# Altium schematic sheet PCB_WOOD-WORKSHOP-REV1.SchDoc
size A4
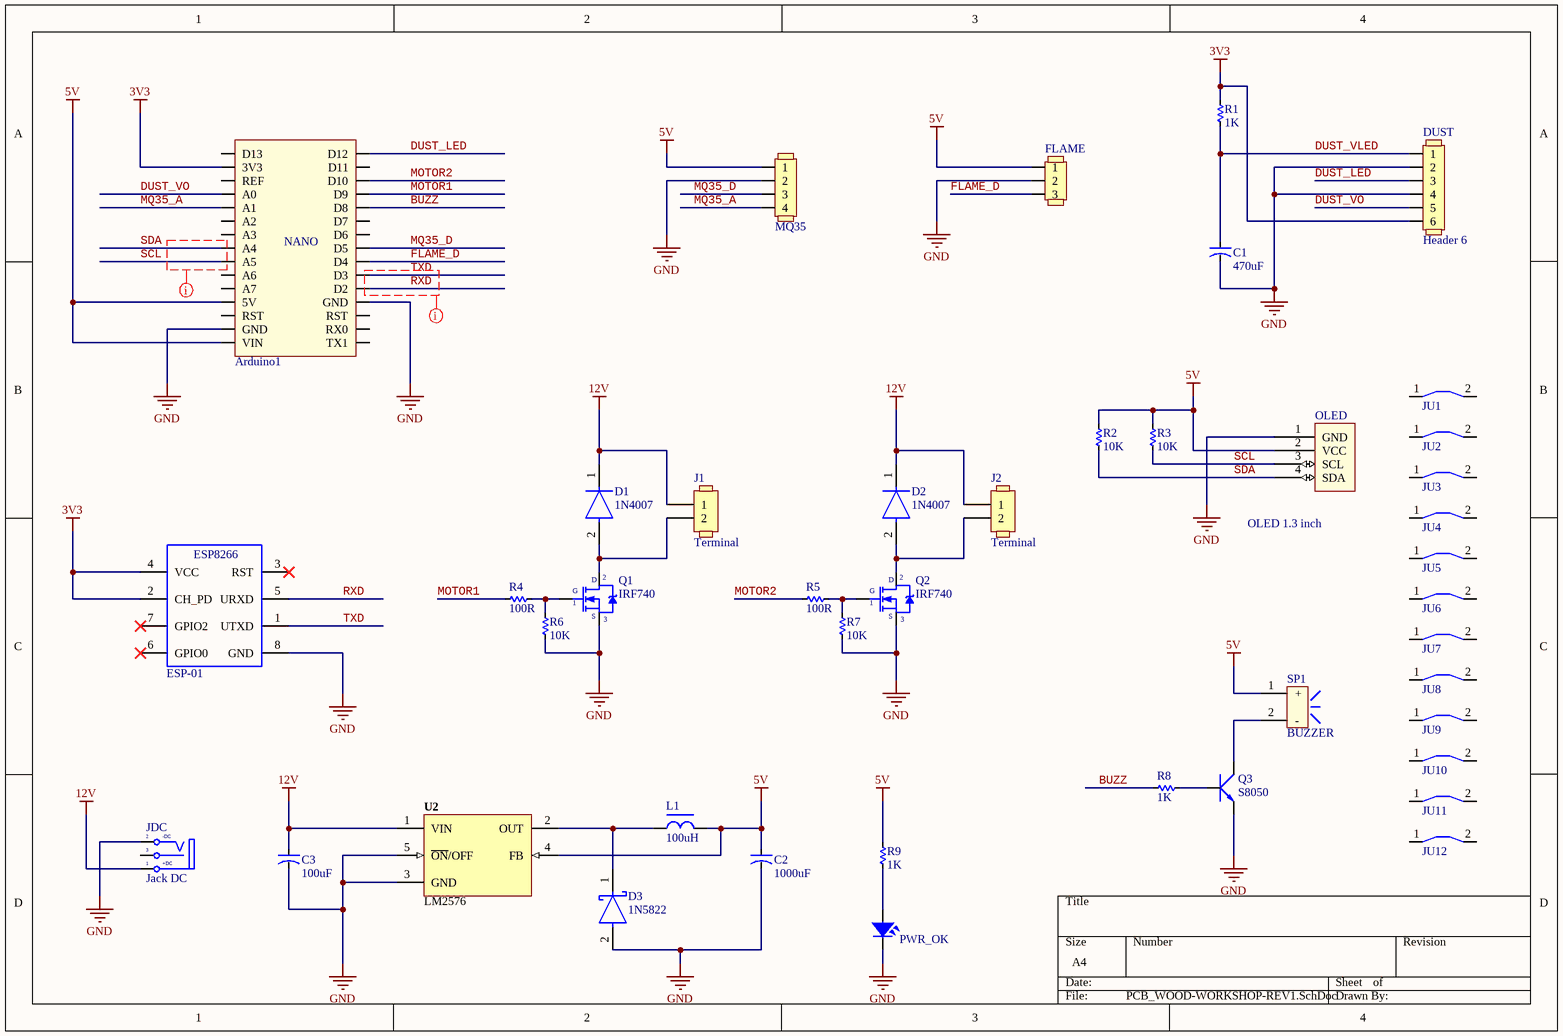
[diagram p0: PCB_WOOD-WORKSHOP-REV1.SchDoc]

## Parts
Arduino1  Arduino Nano  [Arduino Nano]  (value not drawn)
C1  470uF  [CA-ALU-6.3]
C2  1000uF  [CA-ALU-16]
C3  100uF  [CA-ALU-16]
D1  1N4007  [FP-1N4007-MFG]
D2  1N4007  [FP-1N4007-MFG]
D3  1N5822  [FP-DO-201AD-MFG]
DUST  Header 6  [HEADER x6]
FLAME  Header 3  [HEADER x3]  (value not drawn)
J1  Terminal  [Terminal x2 5mm]
J2  Terminal  [Terminal x2 5mm]
JDC  Jack DC  [DC0]
JU1  JUMPER 5MM  [JUMPER 10MM]  (value not drawn)
JU2  JUMPER 5MM  [JUMPER 10MM]  (value not drawn)
JU3  JUMPER 5MM  [JUMPER 10MM]  (value not drawn)
JU4  JUMPER 5MM  [JUMPER 5MM]  (value not drawn)
JU5  JUMPER 5MM  [JUMPER 5MM]  (value not drawn)
JU6  JUMPER 5MM  [JUMPER 15MM]  (value not drawn)
JU7  JUMPER 5MM  [JUMPER 15MM]  (value not drawn)
JU8  JUMPER 5MM  [JUMPER 10MM]  (value not drawn)
JU9  JUMPER 5MM  [JUMPER 5MM]  (value not drawn)
JU10  JUMPER 5MM  [JUMPER 15MM]  (value not drawn)
JU11  JUMPER 5MM  [JUMPER 10MM]  (value not drawn)
JU12  JUMPER 5MM  [JUMPER 15MM]  (value not drawn)
L1  100uH  [L-DIP-M-8]
MQ35  Header 4  [HEADER x4]  (value not drawn)
OLED  OLED 1.3 inch  [OLED 0.96 inch]
PWR_OK  LED  [LED-5-RED]  (value not drawn)
Q1  IRF740  [TO220H1]
Q2  IRF740  [TO220H1]
Q3  S8050  [TO92-123]
R1  1K  [RES-1/4W]
R2  10K  [RES-1/4W]
R3  10K  [RES-1/4W]
R4  100R  [RES-1/4W]
R5  100R  [RES-1/4W]
R6  10K  [RES-1/4W]
R7  10K  [RES-1/4W]
R8  1K  [RES-1/4W]
R9  1K  [RES-1/4W]
SP1  BUZZER  [Buzzer 5V 9x1.2mm]
U1  ESP-01  [ESP8266]
U2  LM2576  [DIP5-T]

## Nets
3V3: Arduino1.3V3 DUST.6 R1.1 U1.2(CH_PD) U1.4(VCC)
5V: Arduino1.5V Arduino1.VIN C2.1 FLAME.1 L1.2 MQ35.1 OLED.2(VCC) R2.1 R3.1 R9.1 SP1.1(+) U2.4(FB)
12V: C3.1 D1.1(C) D2.1(C) J1.1 J2.1 JDC.1(T) U2.1(VIN)
GND: Arduino1.GND C1.2 C2.2 C3.2 D3.2(A) DUST.2 DUST.4 FLAME.2 JDC.2(TN) MQ35.2 OLED.1(GND) PWR_OK.2 Q1.3(S) Q2.3(S) Q3.1(E) R6.2 R7.2 U1.8(GND) U2.3(GND) U2.5(~{ON}/OFF)
BUZZ: Arduino1.D8 R8.2
DUST_LED: Arduino1.D12 DUST.3
DUST_VLED: C1.1 DUST.1 R1.2
DUST_VO: Arduino1.A0 DUST.5
FLAME_D: Arduino1.D4 FLAME.3
MOTOR1: Arduino1.D9 R4.2
MOTOR2: Arduino1.D10 R5.2
MQ35_A: Arduino1.A1 MQ35.4
MQ35_D: Arduino1.D5 MQ35.3
RXD: Arduino1.D2 U1.5(URXD)
SCL: Arduino1.A5 OLED.3(SCL) R3.2
SDA: Arduino1.A4 OLED.4(SDA) R2.2
TXD: Arduino1.D3 U1.1(UTXD)
NetD1_2: D1.2(A) J1.2 Q1.2(D)
NetD2_2: D2.2(A) J2.2 Q2.2(D)
NetD3_1: D3.1(C) L1.1 U2.2(OUT)
NetPWR_OK_1: PWR_OK.1 R9.2
NetQ1_1: Q1.1(G) R4.1 R6.1
NetQ2_1: Q2.1(G) R5.1 R7.1
NetQ3_2: Q3.2(C) SP1.2(-)
NetQ3_3: Q3.3(B) R8.1

Not connected (* = marked no-connect by the designer): Arduino1 A2 A3 A6 A7 D6 D7 D11 D13 REF RST RX0 TX1; JDC 3(S); JU1 1 2; JU2 1 2; JU3 1 2; JU4 1 2; JU5 1 2; JU6 1 2; JU7 1 2; JU8 1 2; JU9 1 2; JU10 1 2; JU11 1 2; JU12 1 2; U1 3(RST)* 6(GPIO0)* 7(GPIO2)*

## Layout directives
net class UART; rule Matched Net Lengths [Tolerance = 0.2mm]: RXD, TXD
net class I2C; rule Matched Net Lengths [Tolerance = 0.2mm]: (no net found under the mark)

## Notes on the sheet
- (in symbol Arduino Nano) NANO
- (in symbol DCIN) -DC; +DC
- (in symbol ESP8266-01) ESP8266

## Library data of the parts
Arduino1 = Arduino Nano: Value: Cau 1A
C1-C3 = CN-ALU-DIP: Capacitor (Semiconductor SIM Model); Value: 104; LatestRevisionDate: 17-Jul-2002; LatestRevisionNote: Re-released for DXP Platform.; PackageReference: C1206; Publisher: Altium Limited
D1 D2 = CMP-123542-000001-1: Rectifier diode 1000 V 1 A DO-41, ,; Manufacturer: Diotec; Max Surge Forward Current: 27A; Forward Current: 1A; Max Junction Temp: +175°C; Reverse Voltage: 1000V; Value: 15pF; Peak Reverse Current: 5uA; Category: Diode; Temperature Range Low: -50°C; Automotive: No; Temperature: -50°C to +175°C; Lead Free: Yes; ComponentLink2Description: Datasheet; Max Repetitive Reverse Voltage: 1000V; ComponentLink2URL: https://datasheet.octopart.com/1N4007-Diotec-datasheet-62346875.pdf; Manufacturer Part Number: 1N4007; Device Class L3: Rectifier Diodes; Height: 2.8mm; Octopart: https://octopart.com/1n4007-diotec-4040411; Package: 1N4007; Temperature Range High: +175°C; Device Class L1: Discrete Semiconductors; Device Class L2: Diodes; RoHS: TRUE; Capacitance: 15pF; Ipc Land Pattern Name: DIOAD888W100L520D280
D3 = CMP-12187-000025-1: DIODE SCHOTTKY 40V 3A DO201AD; Manufacturer: STMicroelectronics; Max Junction Temp: +150°C; Peak Reverse Current: 2mA; Max Surge Forward Current: 80A; Temperature Range High: +150°C; Automotive: No; RoHS: TRUE; ComponentLink2Description: Datasheet; Manufacturer Part Number: 1N5822; Lead Free: Yes; Octopart: https://octopart.com/1n5822-stmicroelectronics-323225; Device Class L2: Diodes; Max Repetitive Reverse Voltage: 40V; Temperature: to +150°C; Height: 5.3mm; Category: Diode; Digikey Description: DIODE SCHOTTKY 40V 3A DO201AD; ComponentLink2URL: https://www.st.com/resource/en/datasheet/1n5822.pdf; Device Class L3: Schottky Diodes; Device Class L1: Discrete Semiconductors; Forward Current: 3A; Mouser Description: Schottky Diodes & Rectifiers Vr/40V Io/3A BULK; Package: DO-201AD
J1 J2 = Terminal x2
JDC = DCIN: Jac DC input; Value: Jac DC
L1 = L-DIP-1: Inductor; Value: 150 mH
OLED = OLED 0.96 inch
PWR_OK = LED: LED Single colour Green and Red; Value: LED 3 ly Single Colour
Q1 Q2 = IRF840: MOSFET N - CHANNEL 500V - 0.75 - 8A - TO-220; Value: IRF840
Q3 = 2SC1815: NPN 600mW, ECB; Value: C1815
R1-R9 = Res: Manufacturer: Generic Components; Class: Passive; SubClass: R; Published: 08/06/2000; Publisher: Altium Hobart Technology Centre
SP1 = Speaker: Buzzer through hole (3V3/5V/12V)
U1 = ESP8266-01: ESP-12 Wi-Fi Module
U2 = LM2576: Max Input Voltage: 12 V; Max Output Current: 3 (6.0 peak) A; Max Output Voltage: mV; Category: IC-Power; Min Input Voltage: mV; Min Output Voltage: mV; Mounting Technology: Surface Mount; Status: Unreleased; Supply Voltage: mV; Temperature Range: -40 to +125 degC